# Altium schematic sheet NVME.SchDoc
size C; SheetNumber: 7; SheetTotal: 19
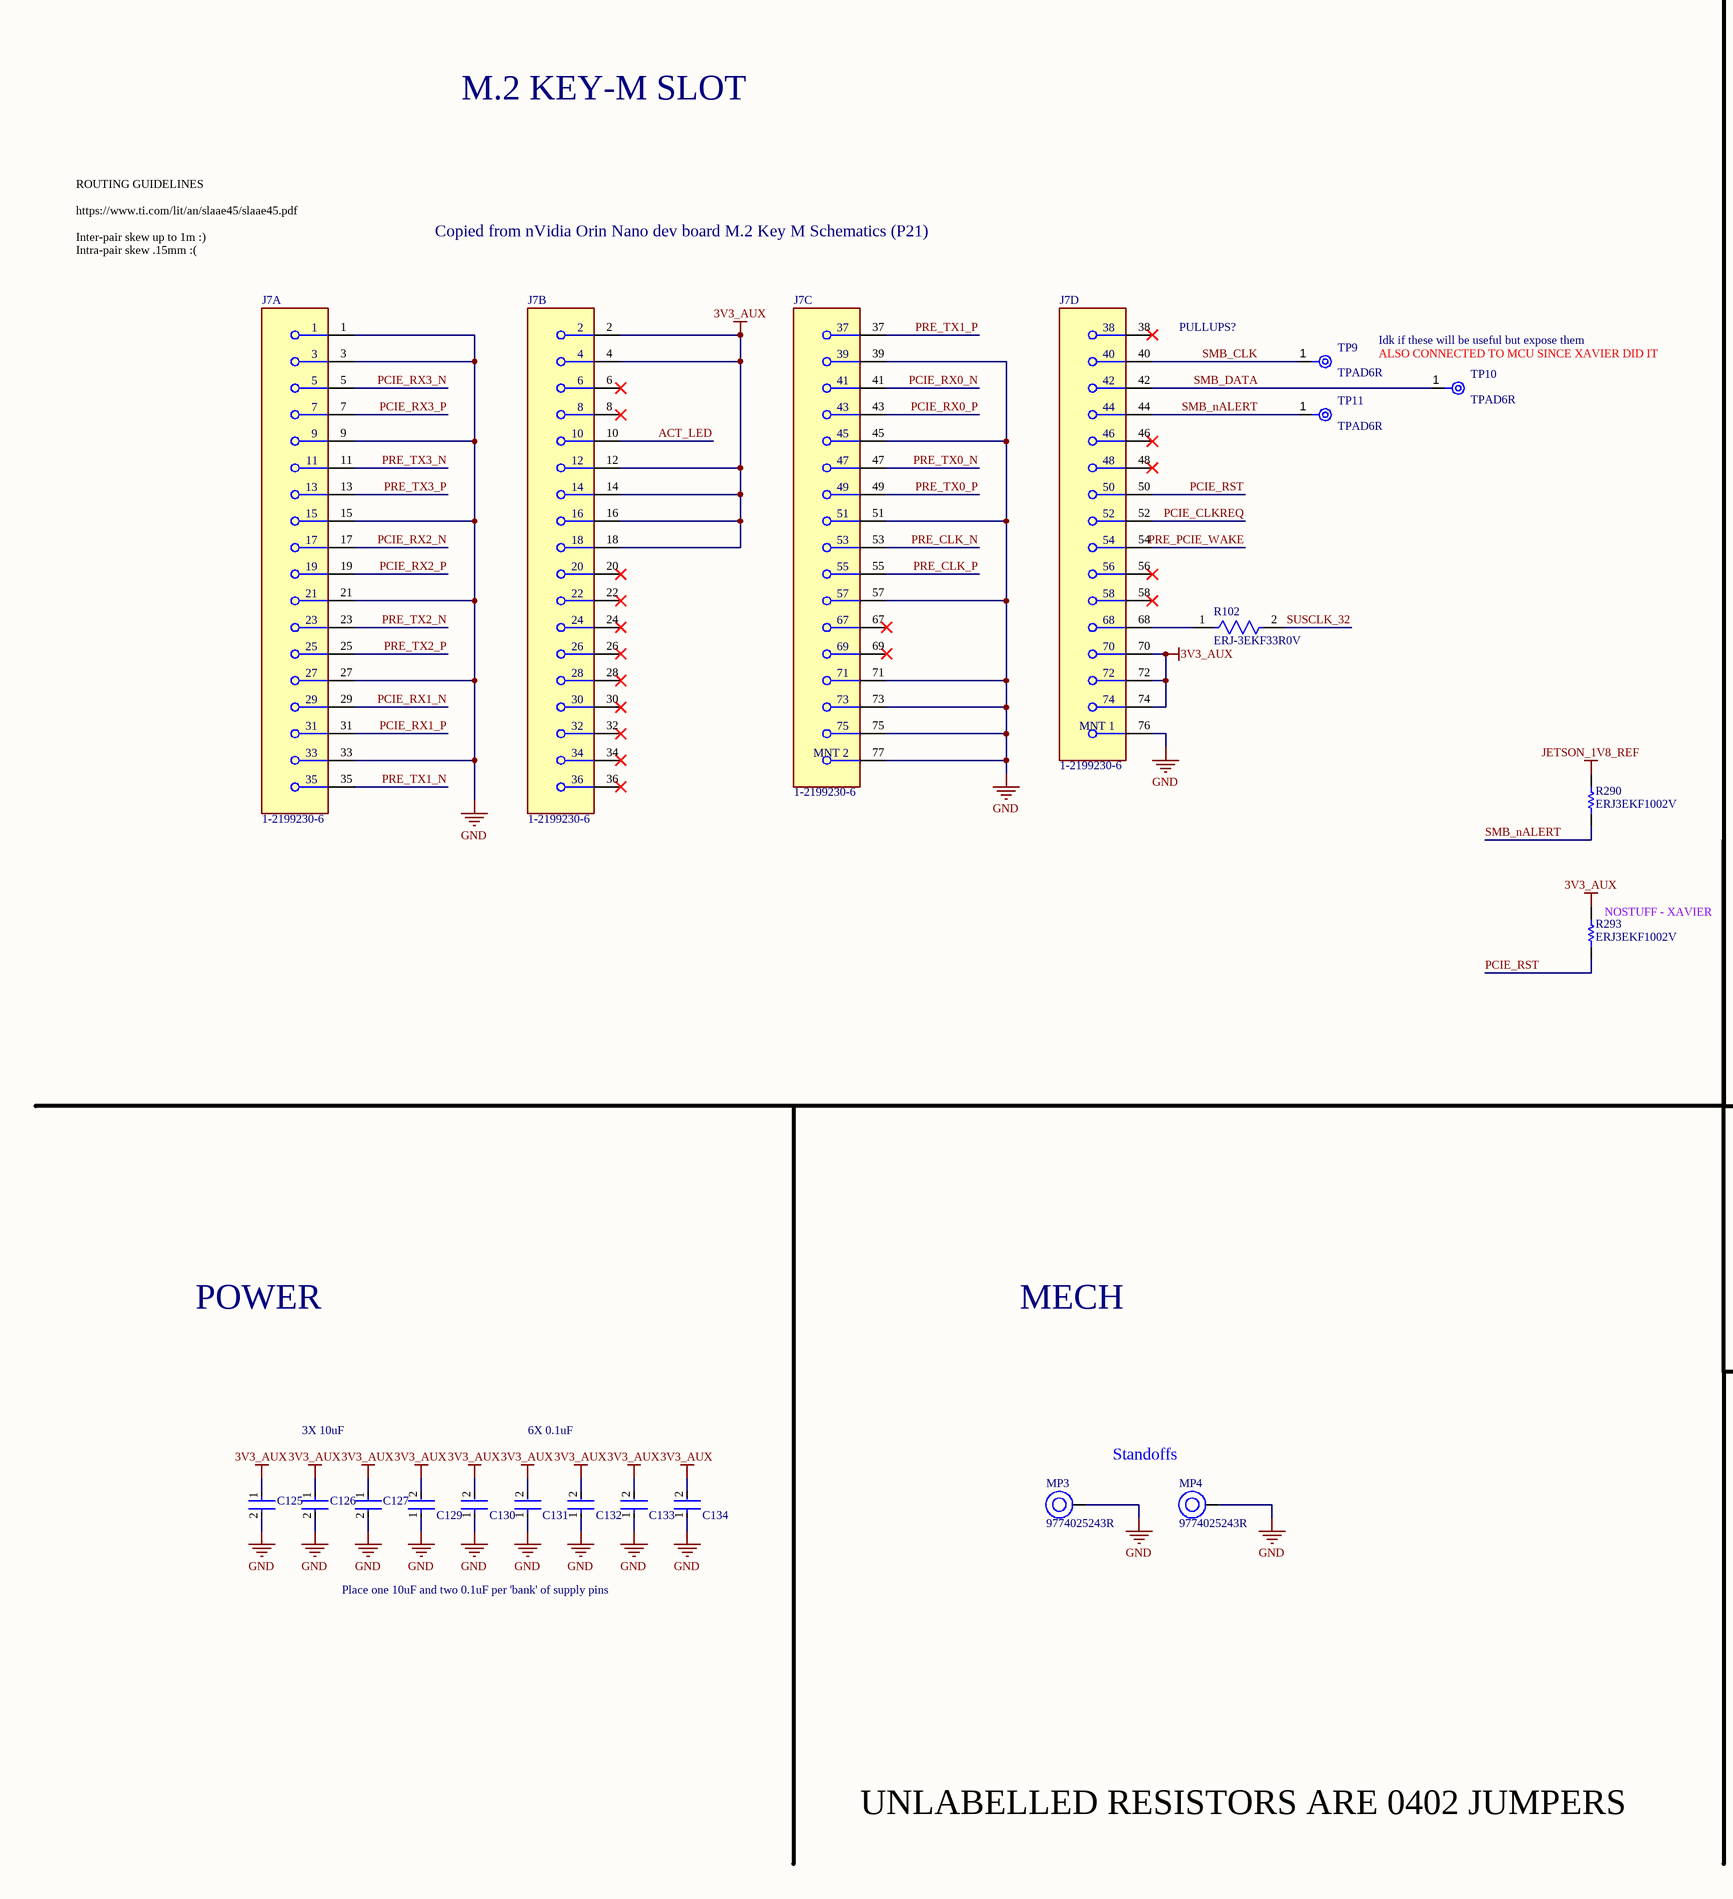
[diagram p0: NVME.SchDoc, left]
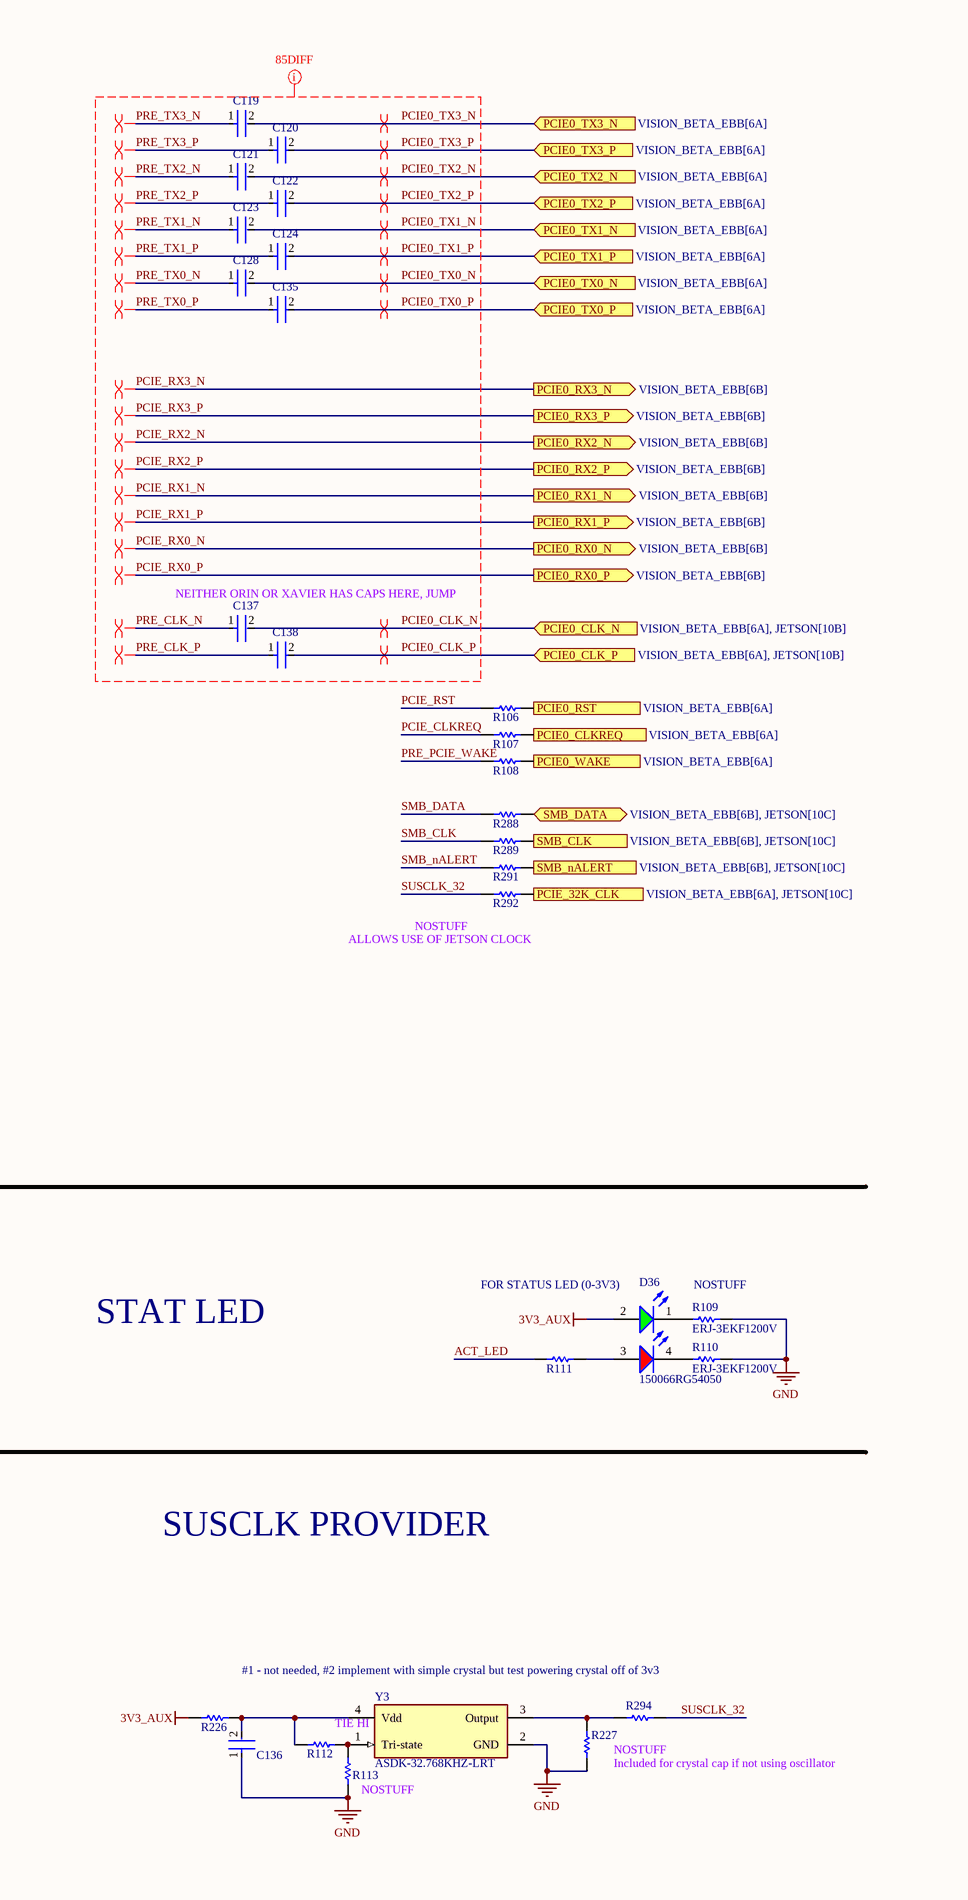
[diagram p1: NVME.SchDoc, right]

## Parts
C119  C1005X7R1A224K050BB  [FP-C1005-050-0_05-IPC_C]  (value not drawn)
C120  C1005X7R1A224K050BB  [FP-C1005-050-0_05-IPC_C]  (value not drawn)
C121  C1005X7R1A224K050BB  [FP-C1005-050-0_05-IPC_C]  (value not drawn)
C122  C1005X7R1A224K050BB  [FP-C1005-050-0_05-IPC_C]  (value not drawn)
C123  C1005X7R1A224K050BB  [FP-C1005-050-0_05-IPC_C]  (value not drawn)
C124  C1005X7R1A224K050BB  [FP-C1005-050-0_05-IPC_C]  (value not drawn)
C125  GRM188R60J106ME47D  [FP-GRM188-0_1-e0_2_0_55-IPC_A]  (value not drawn)
C126  GRM188R60J106ME47D  [FP-GRM188-0_1-e0_2_0_55-IPC_A]  (value not drawn)
C127  GRM188R60J106ME47D  [FP-GRM188-0_1-e0_2_0_55-IPC_A]  (value not drawn)
C128  C1005X7R1A224K050BB  [FP-C1005-050-0_05-IPC_C]  (value not drawn)
C129  C1005X7R1H104K050BB  [FP-C1005-050-0_05-IPC_C]  (value not drawn)
C130  C1005X7R1H104K050BB  [FP-C1005-050-0_05-IPC_C]  (value not drawn)
C131  C1005X7R1H104K050BB  [FP-C1005-050-0_05-IPC_C]  (value not drawn)
C132  C1005X7R1H104K050BB  [FP-C1005-050-0_05-IPC_C]  (value not drawn)
C133  C1005X7R1H104K050BB  [FP-C1005-050-0_05-IPC_C]  (value not drawn)
C134  C1005X7R1H104K050BB  [FP-C1005-050-0_05-IPC_C]  (value not drawn)
C135  C1005X7R1A224K050BB  [FP-C1005-050-0_05-IPC_C]  (value not drawn)
C136  C1005X7R1H104K050BB  [FP-C1005-050-0_05-IPC_C]  (value not drawn)
C137  C1005X7R1A224K050BB  [FP-C1005-050-0_05-IPC_C]  (value not drawn)
C138  C1005X7R1A224K050BB  [FP-C1005-050-0_05-IPC_C]  (value not drawn)
D36  150066RG54050  [WL-SBCD_0606]
J7  1-2199230-6  [FP-1-2199230-6-MFG]  (parts A,B,C,D of 4)
MP3  9774025243R  [9774025243]
MP4  9774025243R  [9774025243]
R102  ERJ-3EKF33R0V  [FP-ERJ3EK-MFG]
R106  0402 JUMPER  [RESC1005X40X25ML05T05]  (value not drawn)
R107  0402 JUMPER  [RESC1005X40X25ML05T05]  (value not drawn)
R108  0402 JUMPER  [RESC1005X40X25ML05T05]  (value not drawn)
R109  ERJ-3EKF1200V  [RESC1609X55X30ML15T15]
R110  ERJ-3EKF1200V  [RESC1609X55X30ML15T15]
R111  0402 JUMPER  [RESC1005X40X25ML05T05]  (value not drawn)
R112  0402 JUMPER  [RESC1005X40X25ML05T05]  (value not drawn)
R113  0402 JUMPER  [RESC1005X40X25ML05T05]  (value not drawn)
R226  0402 JUMPER  [RESC1005X40X25ML05T05]  (value not drawn)
R227  0402 JUMPER  [RESC1005X40X25ML05T05]  (value not drawn)
R288  0402 JUMPER  [RESC1005X40X25ML05T05]  (value not drawn)
R289  0402 JUMPER  [RESC1005X40X25ML05T05]  (value not drawn)
R290  ERJ3EKF1002V  [RESC1609X55X30LL15T15]
R291  0402 JUMPER  [RESC1005X40X25ML05T05]  (value not drawn)
R292  0402 JUMPER  [RESC1005X40X25ML05T05]  (value not drawn)
R293  ERJ3EKF1002V  [RESC1609X55X30LL15T15]
R294  0402 JUMPER  [RESC1005X40X25ML05T05]  (value not drawn)
TP9  TPAD6R  [New footprint 1]
TP10  TPAD6R  [New footprint 1]
TP11  TPAD6R  [New footprint 1]
Y3  ASDK-32.768KHZ-LRT  [FP-ASDK-MFG]

## Ports
PCIE0_CLK_N (in, see VISION_BETA_EBB[6A], JETSON[10B]), PCIE0_CLK_P (in, see VISION_BETA_EBB[6A], JETSON[10B]), PCIE0_CLKREQ (out, see VISION_BETA_EBB[6A]), PCIE0_RST (in, see VISION_BETA_EBB[6A]), PCIE0_RX0_N (out, see VISION_BETA_EBB[6B]), PCIE0_RX0_P (out, see VISION_BETA_EBB[6B]), PCIE0_RX1_N (out, see VISION_BETA_EBB[6B]), PCIE0_RX1_P (out, see VISION_BETA_EBB[6B]), PCIE0_RX2_N (out, see VISION_BETA_EBB[6B]), PCIE0_RX2_P (out, see VISION_BETA_EBB[6B]), PCIE0_RX3_N (out, see VISION_BETA_EBB[6B]), PCIE0_RX3_P (out, see VISION_BETA_EBB[6B]), PCIE0_TX0_N (in, see VISION_BETA_EBB[6A]), PCIE0_TX0_P (in, see VISION_BETA_EBB[6A]), PCIE0_TX1_N (in, see VISION_BETA_EBB[6A]), PCIE0_TX1_P (in, see VISION_BETA_EBB[6A]), PCIE0_TX2_N (in, see VISION_BETA_EBB[6A]), PCIE0_TX2_P (in, see VISION_BETA_EBB[6A]), PCIE0_TX3_N (in, see VISION_BETA_EBB[6A]), PCIE0_TX3_P (in, see VISION_BETA_EBB[6A]), PCIE0_WAKE (out, see VISION_BETA_EBB[6A]), PCIE_32K_CLK (in, see VISION_BETA_EBB[6A], JETSON[10C]), SMB_CLK (in, see VISION_BETA_EBB[6B], JETSON[10C]), SMB_DATA (bidir, see VISION_BETA_EBB[6B], JETSON[10C]), SMB_nALERT (out, see VISION_BETA_EBB[6B], JETSON[10C])

## Nets
3V3_AUX: C125.1 C126.1 C127.1 C129.2 C130.2 C131.2 C132.2 C133.2 C134.2 D36.2(A) J7.2 J7.4 J7.12 J7.14 J7.16 J7.18 J7.70 J7.72 J7.74 R226.1 R293.2
GND: C125.2 C126.2 C127.2 C129.1 C130.1 C131.1 C132.1 C133.1 C134.1 C136.1 J7.1 J7.3 J7.9 J7.15 J7.21 J7.27 J7.33 J7.39 J7.45 J7.51 J7.57 J7.71 J7.73 J7.75 J7.76(MNT_1) J7.77(MNT_2) MP3.1 MP4.1 R109.1 R110.1 R113.1 R227.1 Y3.2(GND)
JETSON_1V8_REF: R290.2
ACT_LED: J7.10 R111.1
PCIE0_CLK_N: C137.2 ; port PCIE0_CLK_N
PCIE0_CLK_P: C138.2 ; port PCIE0_CLK_P
PCIE0_CLKREQ: R107.2 ; port PCIE0_CLKREQ
PCIE0_RST: R106.2 ; port PCIE0_RST
PCIE0_TX0_N: C128.2 ; port PCIE0_TX0_N
PCIE0_TX0_P: C135.2 ; port PCIE0_TX0_P
PCIE0_TX1_N: C123.2 ; port PCIE0_TX1_N
PCIE0_TX1_P: C124.2 ; port PCIE0_TX1_P
PCIE0_TX2_N: C121.2 ; port PCIE0_TX2_N
PCIE0_TX2_P: C122.2 ; port PCIE0_TX2_P
PCIE0_TX3_N: C119.2 ; port PCIE0_TX3_N
PCIE0_TX3_P: C120.2 ; port PCIE0_TX3_P
PCIE0_WAKE: R108.2 ; port PCIE0_WAKE
PCIE_32K_CLK: R292.2 ; port PCIE_32K_CLK
PCIE_CLKREQ: J7.52 R107.1
PCIE_RST: J7.50 R106.1 R293.1
PCIE_RX0_N: J7.41 ; port PCIE0_RX0_N
PCIE_RX0_P: J7.43 ; port PCIE0_RX0_P
PCIE_RX1_N: J7.29 ; port PCIE0_RX1_N
PCIE_RX1_P: J7.31 ; port PCIE0_RX1_P
PCIE_RX2_N: J7.17 ; port PCIE0_RX2_N
PCIE_RX2_P: J7.19 ; port PCIE0_RX2_P
PCIE_RX3_N: J7.5 ; port PCIE0_RX3_N
PCIE_RX3_P: J7.7 ; port PCIE0_RX3_P
PRE_CLK_N: C137.1 J7.53
PRE_CLK_P: C138.1 J7.55
PRE_PCIE_WAKE: J7.54 R108.1
PRE_TX0_N: C128.1 J7.47
PRE_TX0_P: C135.1 J7.49
PRE_TX1_N: C123.1 J7.35
PRE_TX1_P: C124.1 J7.37
PRE_TX2_N: C121.1 J7.23
PRE_TX2_P: C122.1 J7.25
PRE_TX3_N: C119.1 J7.11
PRE_TX3_P: C120.1 J7.13
SMB_CLK: J7.40 R289.1 TP9.1(TP)
SMB_CLK: R289.2 ; port SMB_CLK  [a separate net that carries the same name]
SMB_DATA: J7.42 R288.1 TP10.1(TP)
SMB_DATA: R288.2 ; port SMB_DATA  [a separate net that carries the same name]
SMB_nALERT: J7.44 R290.1 R291.1 TP11.1(TP)
SMB_nALERT: R291.2 ; port SMB_nALERT  [a separate net that carries the same name]
SUSCLK_32: R102.2 R292.1 R294.1
NetC136_2: C136.2 R112.1 R226.2 Y3.4(Vdd)
NetD36_1: D36.1(K) R109.2
NetD36_3: D36.3(A) R111.2
NetD36_4: D36.4(K) R110.2
NetJ7_68: J7.68 R102.1
NetR112_2: R112.2 R113.2 Y3.1(Tri-state)
NetR227_2: R227.2 R294.2 Y3.3(Output)

Not connected (* = marked no-connect by the designer): J7 6* 8* 20* 22* 24* 26* 28* 30* 32* 34* 36* 38* 46* 48* 56* 58* 67* 69*

## Layout directives
differential pair; differential pair class 85DIFF: PCIE0_CLK_N, PCIE0_CLK_P, PCIE0_TX0_N, PCIE0_TX0_P, PCIE0_TX1_N, PCIE0_TX1_P, PCIE0_TX2_N, PCIE0_TX2_P, PCIE0_TX3_N, PCIE0_TX3_P, PCIE_RX0_N, PCIE_RX0_P, PCIE_RX1_N, PCIE_RX1_P, PCIE_RX2_N, PCIE_RX2_P, PCIE_RX3_N, PCIE_RX3_P, PRE_CLK_N, PRE_CLK_P, PRE_TX0_N, PRE_TX0_P, PRE_TX1_N, PRE_TX1_P, PRE_TX2_N, PRE_TX2_P, PRE_TX3_N, PRE_TX3_P
net class 85DIFF: PCIE0_CLK_N, PCIE0_CLK_P, PCIE0_TX0_N, PCIE0_TX0_P, PCIE0_TX1_N, PCIE0_TX1_P, PCIE0_TX2_N, PCIE0_TX2_P, PCIE0_TX3_N, PCIE0_TX3_P, PCIE_RX0_N, PCIE_RX0_P, PCIE_RX1_N, PCIE_RX1_P, PCIE_RX2_N, PCIE_RX2_P, PCIE_RX3_N, PCIE_RX3_P, PRE_CLK_N, PRE_CLK_P, PRE_TX0_N, PRE_TX0_P, PRE_TX1_N, PRE_TX1_P, PRE_TX2_N, PRE_TX2_P, PRE_TX3_N, PRE_TX3_P

## Notes on the sheet
- M.2 KEY-M SLOT
- ROUTING GUIDELINES
  https://www.ti.com/lit/an/slaae45/slaae45.pdf
  Inter-pair skew up to 1m :)
  Intra-pair skew .15mm :(
- Copied from nVidia Orin Nano dev board M.2 Key M Schematics (P21)
- PULLUPS?
- (near TP10) Idk if these will be useful but expose them
- (near TP10) ALSO CONNECTED TO MCU SINCE XAVIER DID IT
- (near C137) NEITHER ORIN OR XAVIER HAS CAPS HERE, JUMP
- (near R292) ALLOWS USE OF JETSON CLOCK
- NOSTUFF
- (near R293) NOSTUFF - XAVIER
- STAT LED
- (near D36) FOR STATUS LED (0-3V3)
- (near R109) NOSTUFF
- POWER
- MECH
- 3X 10uF
- 6X 0.1uF
- Standoffs
- SUSCLK PROVIDER
- Place one 10uF and two 0.1uF per 'bank' of supply pins
- #1 - not needed, #2 implement with simple crystal but test powering crystal off of 3v3
- (near Y3) TIE HI
- (near R113) NOSTUFF
- Included for crystal cap if not using oscillator
- UNLABELLED RESISTORS ARE 0402 JUMPERS

## Library data of the parts
C119-C124 C128 C135 C137 C138 = CMP-08246-006072-1: Multilayer Ceramic Capacitors 220nF ±10% 10V X7R SMD 0402; Resistor Type: Ceramic; Dielectric: X7R; Voltage Rating (DC): 10V; Width: 0.02inch; Case Code (Metric): 1005; Mount: Surface Mount; Termination: SMD/SMT; Series: C; Tolerance: 10%; Depth: 0.5mm; Length: 1mm; Packaging: Tape and Reel; Radiation Hardening: No; Weight: 2.3E-05oz; Voltage Rating: 10V; Thickness: 0.022inch; Capacitance: 220nF; Case Code (Imperial): 0402; Lead Free: Lead Free; Case/Package: 0402; Package Quantity: 10000; Dielectric Material: Ceramic; RoHS Compliant: Yes; REACH SVHC: No SVHC; Min Operating Temperature: -55°C; Max Operating Temperature: 125°C; Height: 0.5mm; Construction: Flat
C125-C127 = CMP-2006-02792-2: Chip Multilayer Ceramic Capacitors for General Purpose, 0603, 10uF, X5R, 15%, 20%, 6.3V; Packaging: Tape and Reel; Voltage Rating (DC): 6.3V; Width: 0.031inch; Termination: SMD/SMT; Dielectric: X5R; Package Quantity: 4000; Voltage Rating: 6.3V; Capacitance: 10uF; Case/Package: 0603; Min Operating Temperature: -55°C; Voltage: 6.3V; Length: 1.6mm; Thickness: 0.035inch; Lead Free: Lead Free; Depth: 0.8mm; Case Code (Imperial): 0603; Max Operating Temperature: 85°C; Material: Ceramic; Height: 0.8mm; Tolerance: 20%; Mount: Surface Mount; REACH SVHC: No SVHC; Radiation Hardening: No; Case Code (Metric): 1608
C129-C134 C136 = CMP-2000-05393-2: Multilayer Ceramic Capacitors 100nF ±10% 50V X7R SMD 0402; Voltage: 50V; Dielectric Material: Ceramic; Min Operating Temperature: -55°C; Depth: 0.5mm; Radiation Hardening: No; RoHS Compliant: Yes; Voltage Rating (DC): 50V; Lead Free: Lead Free; Resistor Type: Ceramic; Height: 0.5mm; Dielectric: X7R; Thickness: 0.022inch; Case/Package: 0402; Case Code (Metric): 1005; Termination: SMD/SMT; Capacitance: 100nF; Packaging: Tape and Reel; Max Operating Temperature: 125°C; Mount: Surface Mount; Package Quantity: 1; Width: 0.02inch; Weight: 2.3E-05oz; Voltage Rating: 50V; Tolerance: 10%; Construction: Flat; Case Code (Imperial): 0402; Length: 1mm; REACH SVHC: No SVHC; Series: C
D36 = CMP-004-00040-2: Led, Red/Grn, 180Mcd/230Mcd, 624Nm/525Nm Rohs Compliant: Yes; Source: rgled.SchLib; Component Type: Standard; Pins: 4; Design Item ID: CMP-004-00034-2
J7 = CMP-03365-000001-1: CONN EDGE DUAL FMALE 67POS 0.020; Manufacturer: TE; Number Of Contacts: 67; Current Rating: 0.5A; Pitch: 0.5mm; Conn Gender: Female; Is Female: yes; Voltage Rating: 50V; Conn Orientation: Right Angle; Automotive: No; Temperature Range High: +80°C; Package: 1-2199230-6; Category: Conn; Temperature: -40°C to +80°C; Number Of Rows: 2; ComponentLink2URL: http://www.te.com/commerce/DocumentDelivery/DDEController?Action=showdoc&DocId=Specification+Or+Standard%7F114-115006%7FB%7Fpdf%7FEnglish%7FENG_SS_114-115006_B_114-115006_REV_B.pdf%7F1-2199230-6; Manufacturer Part Number: 1-2199230-6; Height: 4.2mm; RoHS: TRUE; Footprint Url: http://www.te.com/commerce/DocumentDelivery/DDEController?Action=showdoc&DocId=Customer+Drawing%7F2199230%7FB2%7Fpdf%7FEnglish%7FENG_CD_2199230_B2.pdf%7F1-2199230-6; Digikey Description: CONN EDGE DUAL FMALE 67POS 0.020; Device Class L2: Card Edge Connectors; Contact Material: Gold,Tin; Device Class L1: Connectors; Device Class L3: unset; ComponentLink2Description: Datasheet; Temperature Range Low: -40°C; Octopart: https://octopart.com/1-2199230-6-te+connectivity-34969376; Lead Free: Yes
MP3 MP4 = CMP-03913-59774857-1: 9774025243R Spacer Material: Steel, Tin-Plated Mounting: SMT Series: WA-SMST Thread D: M2; Outside Diameter: 4.3434mm; Threaded/Unthreaded: Threaded; Plating: Tin; REACH SVHC: Unknown; NexarPartId: 59774857; RoHS: Compliant; Material: Steel; Packaging: Tape and Reel; Max Operating Temperature: 150°C; Min Operating Temperature: -55°C; Length: 2.5mm; Height: 2.5mm
R102 = CMP-2000-00443-2: RES SMD 33 OHM 1% 1/10W 0603; Voltage Rating (DC): 75V; Power Rating: 100mW; Resistance: 33R; Temperature Coefficient: 100ppm/°C; Min Operating Temperature: -55°C; Packaging: Tape and Reel; Mount: Surface Mount; Lead Free: Lead Free; Voltage Rating: 75V; Features: Automotive AEC-Q200; Height: 0.022inch; Width: 0.031inch; Number of Pins: 2; Package Quantity: 1; Case Code (Metric): 1608; Max Power Dissipation: 100mW; Case Code (Imperial): 0603; Termination: SMD/SMT; Resistance Tolerance: 1%; Max Operating Temperature: 155°C; Tolerance: 1%; Length: 1.6mm; Case/Package: 0603; Military Standard: Not; RoHS Compliant: Yes; Series: ERJ; Size Code: 0603; Construction: Rectangular; Number of Terminations: 2; Radiation Hardening: No; Resistor Type: Thick Film; Contact Plating: Tin; Depth: 0.8mm; REACH SVHC: No SVHC
R106-R108 R111-R113 R226 R227 R288 R289 R291 R292 R294 = CMP-009-00118-2: READ THE NAME; Pins: 2; Component Type: Standard; Design Item ID: CMP-009-00206-2; Source: 0402jump.SchLib
R109 R110 = CMP-2000-00213-2: Chip Resistor, 120 Ohm, +/- 1%, 0.1 W, -55 to 155 degC, 0603 (1608 Metric), RoHS, Tape and Reel; Manufacturer: Panasonic; Power Rating: 100mW; Voltage Rating (DC): 75V; Resistance: 120Ohm; Temperature Coefficient: 100ppm/degreesC; Number of Terminations: 2; Military Standard: Not; Tolerance: 1%; Min Operating Temperature: -55degC; Packaging: TapeandReel; Lead Free: LeadFree; Max Operating Temperature: 155degC; Manufacturer URL: http://www.panasonic.com/; Case Code (Imperial): 0603; REACH SVHC: NoSVHC; Width: 0.031inch; Datasheet URL: https://industrial.panasonic.com/cdbs/www-data/pdf/RDA0000/AOA0000C283.pdf; RoHSCompliant: true; Max Power Dissipation: 100mW; Termination: SMD/SMT; Package Reference: 0603; Height: 0.022inch; Depth: 0.8mm; Package Description: 2-Pin Surface Mount Device, Body 1.6 x 0.85 mm; Contact Plating: Tin; Length: 1.6mm; Package URL: http://www.st.com/st-web-ui/static/active/en/resource/technical/document/datasheet/CD00001320.pdf; Radiation Hardening: No; Package Quantity: 1; Number of Pins: 2; Datasheet Version: 42095.0; Voltage Rating: 75V; Composition: ThickFilm; Case/Package: 0603; Mount: SurfaceMount; Case Code (Metric): 1608
R290 R293 = CMP-1012-00623-3: Chip Resistor, 10 KOhm, +/- 1%, 0.1 W, -55 to 155 degC, 0603 (1608 Metric), RoHS, Tape and Reel; Manufacturer: Panasonic; Voltage Rating: 75V; Case\/Package: 0603; Power Rating: 100mW; Resistance: 10KOhm; Temperature Coefficient: 100ppm\/degreesC; Number of Pins: 2; Package Reference: 603; Depth: 0.8mm; Mount: SurfaceMount; Package Description: 2-Pin Surface Mount Device, Body 1.6 x 0.85 mm; Datasheet Version: 02/2017; Length: 1.6mm; Lead Free: LeadFree; Height: 0.45mm; Number of Terminations: 2; Max Power Dissipation: 100mW; Min Operating Temperature: -55degC; Datasheet URL: https://industrial.panasonic.com/cdbs/www-data/pdf/RDA0000/AOA0000C304.pdf; Termination: SMD/SMT; Case Code (Metric): 1608; Case Code (Imperial): 0603; Tolerance: 1%; Max Operating Temperature: 155degC; RoHSCompliant: true; Voltage Rating (DC): 75V; Radiation Hardening: No; Packaging: TapeandReel; Composition: ThickFilm; Mounting Technology: SurfaceMount; Manufacturer URL: http://www.panasonic.com/; Width: 0.031inch; REACH SVHC: NoSVHC; Contact Plating: Tin; Military Standard: Not; Package Quantity: 1
TP9-TP11 = CMP-00025-2: Test Point .6mm
Y3 = CMP-27762-001115-1: XTAL OSC XO 32.7680KHZ CMOS SMD; Load Capacitance: 15pF; Max Supply Current: 3.5mA; Min Supply Voltage: 2.97V; Operating Supply Voltage: 3.3V; Frequency Stability: 25ppm; Lead Free: Lead Free; Case/Package: CSMD; Number of Pins: 4; Max Operating Temperature: 85°C; Packaging: Tape and Reel; Width: 0.079inch; Min Operating Temperature: -40°C; Radiation Hardening: No; Length: 2.5mm; Depth: 2mm; Termination: SMD/SMT; Height: 0.037inch; Series: ASDK; Frequency: 32.768kHz; Mount: Surface Mount